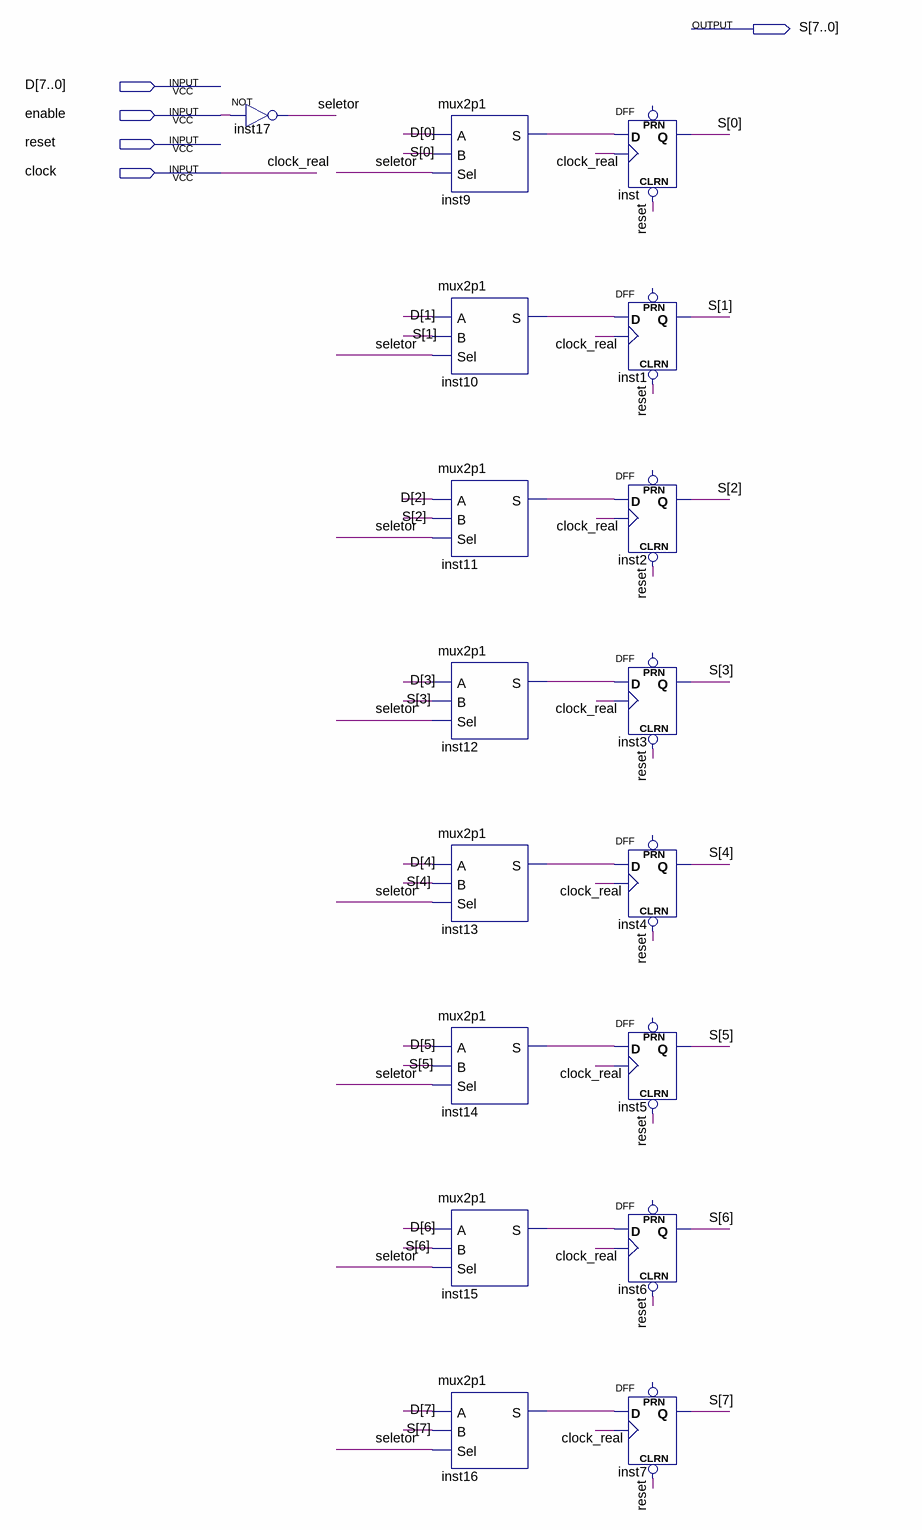
[diagram p0: schematic sheet]
// Quartus schematic register8b.bdf as structural Verilog: 17 symbols, 5 pins
module register8b (
  input  [7:0] D,
  input  enable,
  input  reset,
  input  clock,
  output [7:0] S
);

  wire inst9_s, inst10_s, inst11_s, inst12_s, inst13_s, inst14_s, inst15_s, inst16_s, seletor;

  not inst17 (seletor, enable);
  mux2p1 inst9 (.A(D[0]), .B(S[0]), .Sel(seletor), .S(inst9_s));
  mux2p1 inst10 (.A(D[1]), .B(S[1]), .Sel(seletor), .S(inst10_s));
  mux2p1 inst11 (.A(D[2]), .B(S[2]), .Sel(seletor), .S(inst11_s));
  mux2p1 inst12 (.A(D[3]), .B(S[3]), .Sel(seletor), .S(inst12_s));
  mux2p1 inst13 (.A(D[4]), .B(S[4]), .Sel(seletor), .S(inst13_s));
  mux2p1 inst14 (.A(D[5]), .B(S[5]), .Sel(seletor), .S(inst14_s));
  mux2p1 inst15 (.A(D[6]), .B(S[6]), .Sel(seletor), .S(inst15_s));
  mux2p1 inst16 (.A(D[7]), .B(S[7]), .Sel(seletor), .S(inst16_s));
  DFF inst (.CLRN(reset), .CLK(clock), .D(inst9_s), .Q(S[0]));  // open: PRN
  DFF inst1 (.CLRN(reset), .CLK(clock), .D(inst10_s), .Q(S[1]));  // open: PRN
  DFF inst2 (.CLRN(reset), .CLK(clock), .D(inst11_s), .Q(S[2]));  // open: PRN
  DFF inst3 (.CLRN(reset), .CLK(clock), .D(inst12_s), .Q(S[3]));  // open: PRN
  DFF inst4 (.CLRN(reset), .CLK(clock), .D(inst13_s), .Q(S[4]));  // open: PRN
  DFF inst5 (.CLRN(reset), .CLK(clock), .D(inst14_s), .Q(S[5]));  // open: PRN
  DFF inst6 (.CLRN(reset), .CLK(clock), .D(inst15_s), .Q(S[6]));  // open: PRN
  DFF inst7 (.CLRN(reset), .CLK(clock), .D(inst16_s), .Q(S[7]));  // open: PRN

  // Other names for the same wires on the sheet: clock_real = clock
endmodule
